# EasyEDA Pro project 5VBuck_MP2236_P1.epro

# Schematic 5VBuck_MP2236
Board Name: Board1; Create Date: 2024-12-13; Page Name: 5VBuck_MP2236_P1; Project Name: 5VBuck_MP2236; Schematic Name: 5VBuck_MP2236; Update Date: 2024-12-14; Company: 嘉立创EDA; Page Size: A4; Version: V1.0
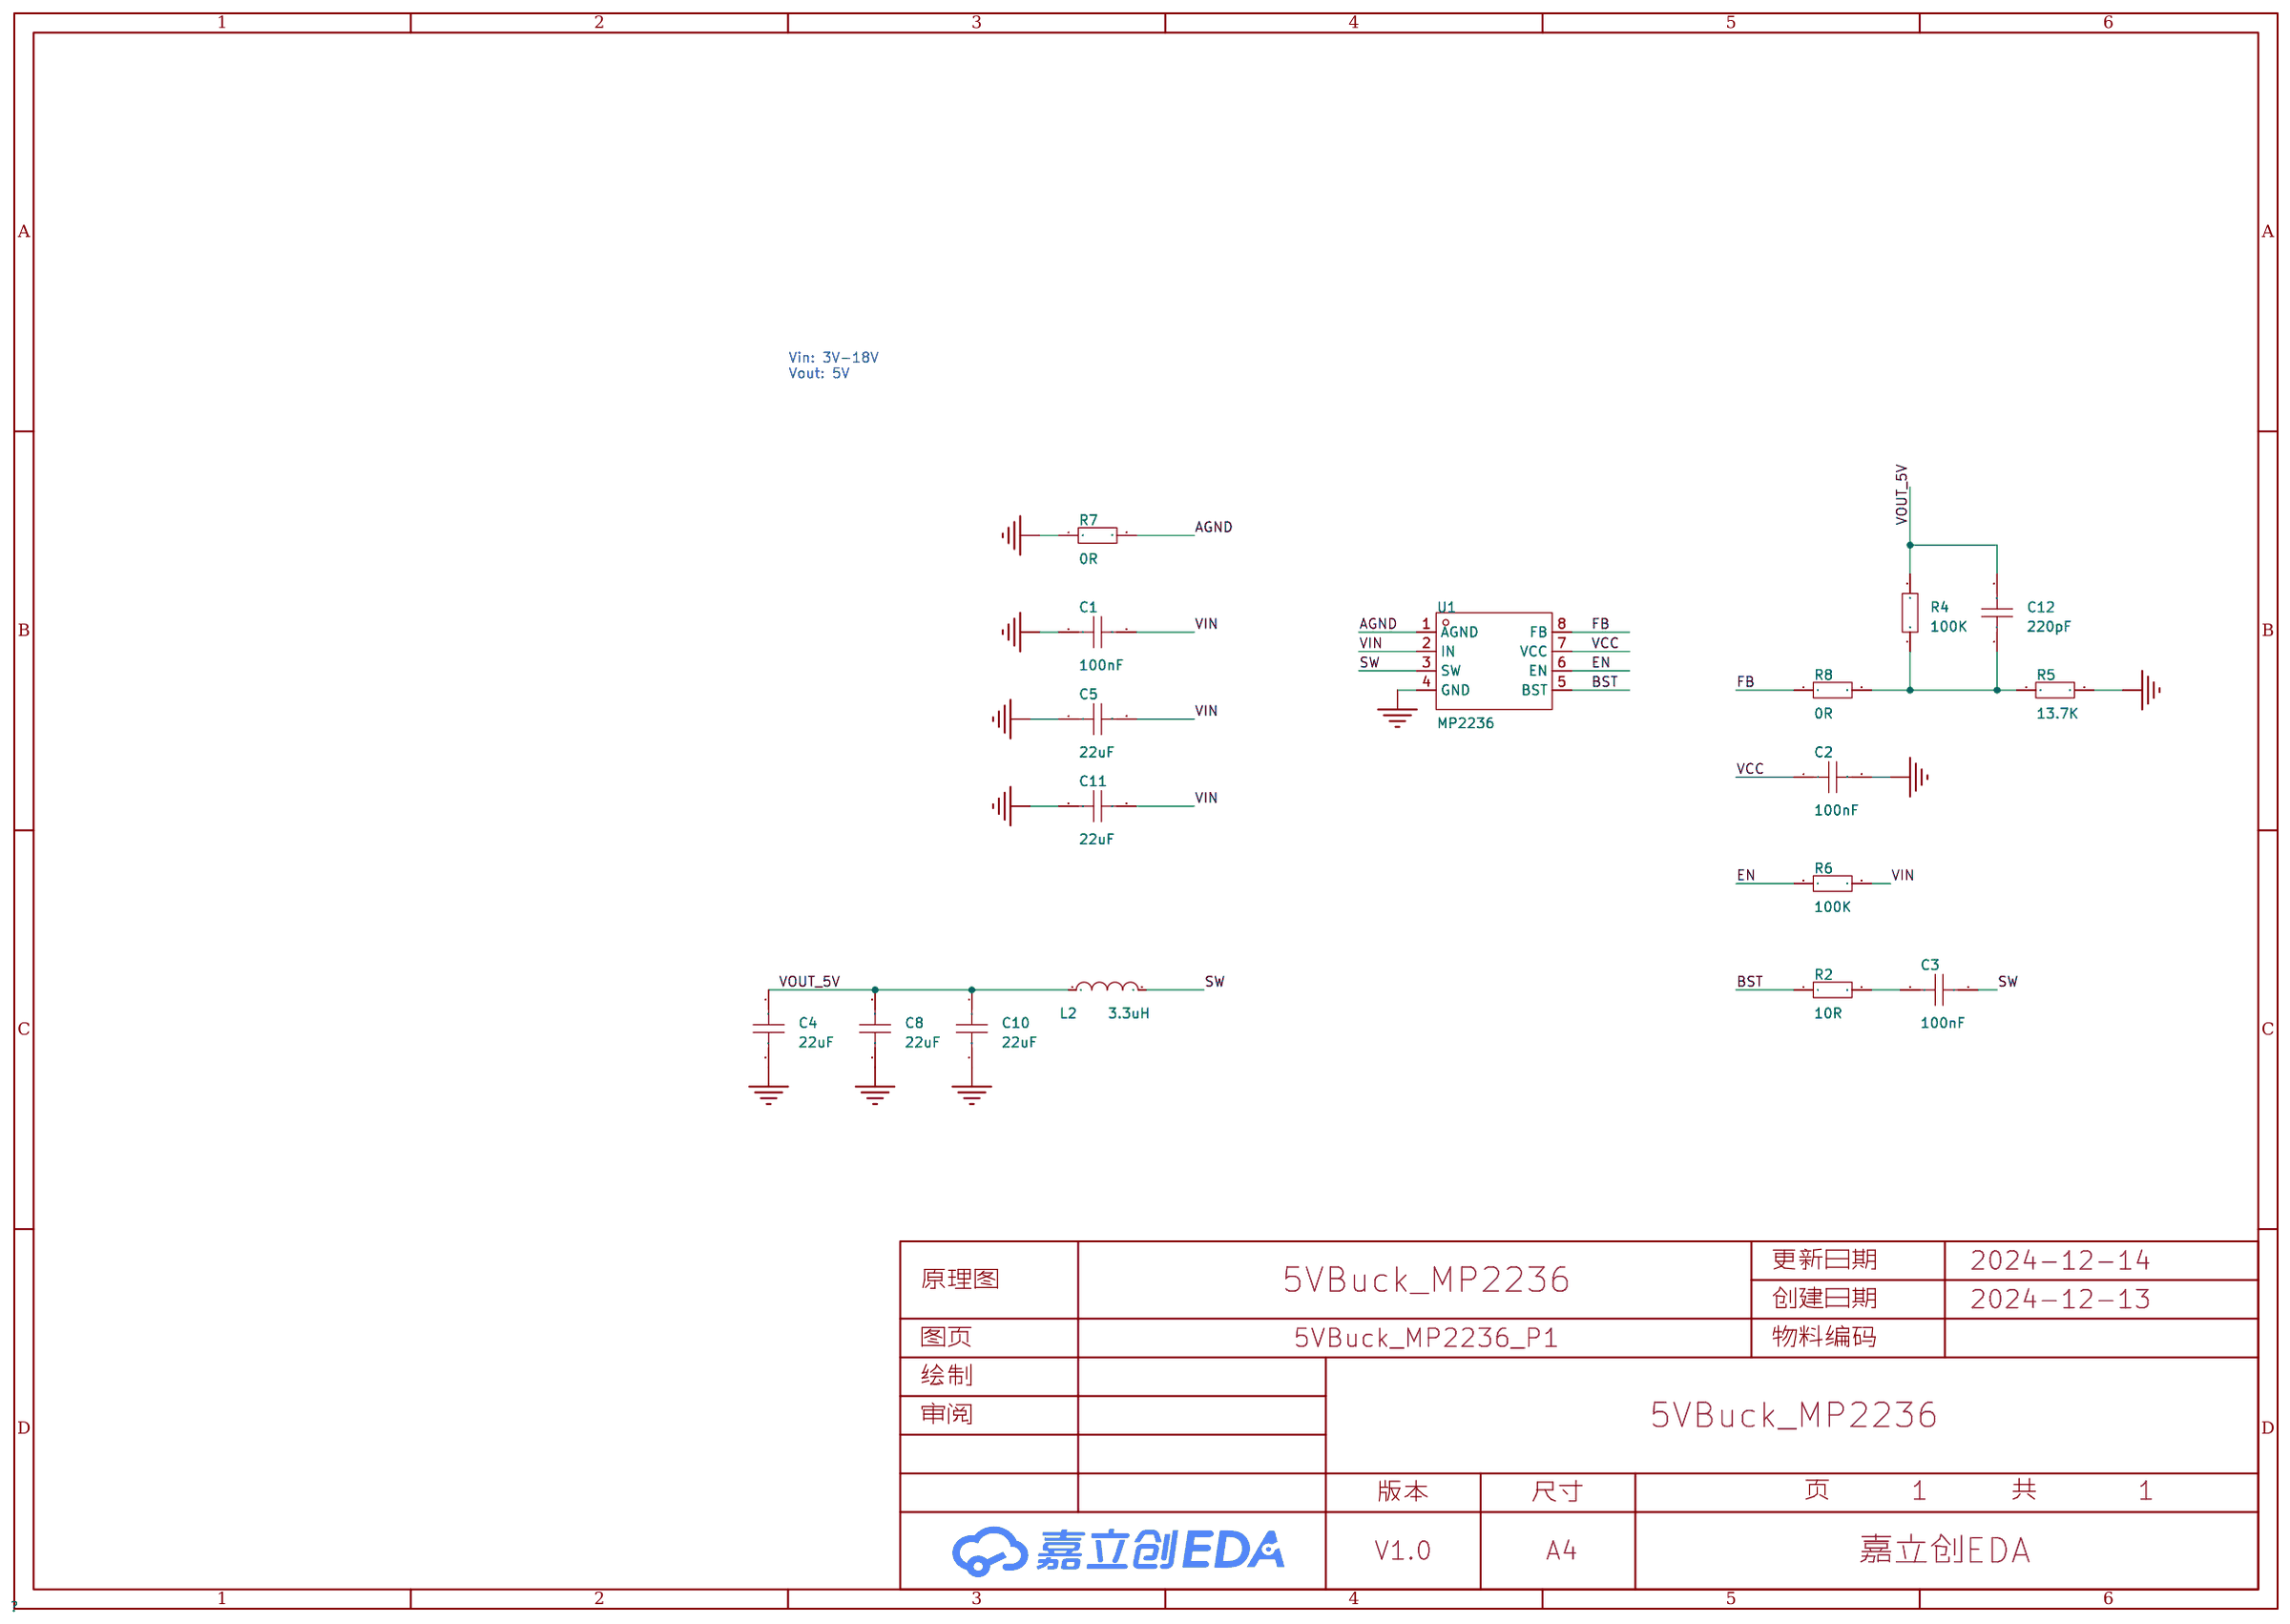
[diagram p0: schematic sheet]

## Parts
C1  100nF  [C0805]
C2  100nF  [C0805]
C3  100nF  [C0805]
C4  22uF  [C0805]
C5  22uF  [C0805]
C8  22uF  [C0805]
C10  22uF  [C0805]
C11  22uF  [C0805]
C12  220pF  [C0805]
L2  3.3uH  [IND-SMD_L7.1-W6.6_MJC-0603T]
R2  10R  [R0805]
R4  100K  [R0805]
R5  13.7K  [R0805]
R6  100K  [R0805]
R7  0R  [R0805]
R8  0R  [R0805]
U1  MP2236  [SOT-23-8_L3.0-W1.7-P0.65-LS2.8-BL]

## Library data of the parts
C1-C5 C8 C10-C12 = CAP_0805: Supplier Footprint: 0805
L2 = CXP0630-5R6M-AG(5.6uh): 电感值:5.6uH;精度:±20%;额定电流:5.5A;饱和电流(Isat):7A;类型:一体成型电感;; LCSC Part Name: 5.6uH ±20% 7A; Supplier Part: C7461360; Manufacturer: DMBJ(振宝佳); Supplier Footprint: 0630; Datasheet: https://atta.szlcsc.com/upload/public/pdf/source/20230706/7F3A5B39C5AD80A91C9FA782B54A296B.pdf; Supplier: LCSC; Tolerance: ±20%; Rated Current: 5.5A; Saturation Current (Isat): 7A; DC Resistance (DCR): 42mΩ; Type: 一体成型电感
R2 R4-R8 = Res_0805: Supplier Footprint: 0805
U1 = MP2236: Supplier Part: C9900030582; Supplier Footprint: SOT23-8; JLCPCB Part Class: 扩展库; Supplier: LCSC

## Nets
AGND: R7.2 U1.1(AGND)
GND: C1.1 C2.2 C4.2 C5.1 C8.2 C10.2 C11.1 R5.2 R7.1 U1.4(GND)
VCC: C2.1 U1.7(VCC)
VIN: C1.2 C5.2 C11.2 R6.1 U1.2(IN)
BST: R2.1 U1.5(BST)
EN: R6.2 U1.6(EN)
FB: R8.1 U1.8(FB)
SW: C3.2 L2.2 U1.3(SW)
VOUT_5V: C4.1 C8.1 C10.1 C12.2 L2.1 R4.2
Net-(C3-1): C3.1 R2.2
Net-(C12-1): C12.1 R4.1 R5.1 R8.2

## Notes on the sheet
- Vin: 3V-18V
  Vout: 5V
